# Altium schematic sheet SAMA7D65_PMIC.SchDoc
size 420 x 297 mm; SheetNumber: 6; SheetTotal: 23
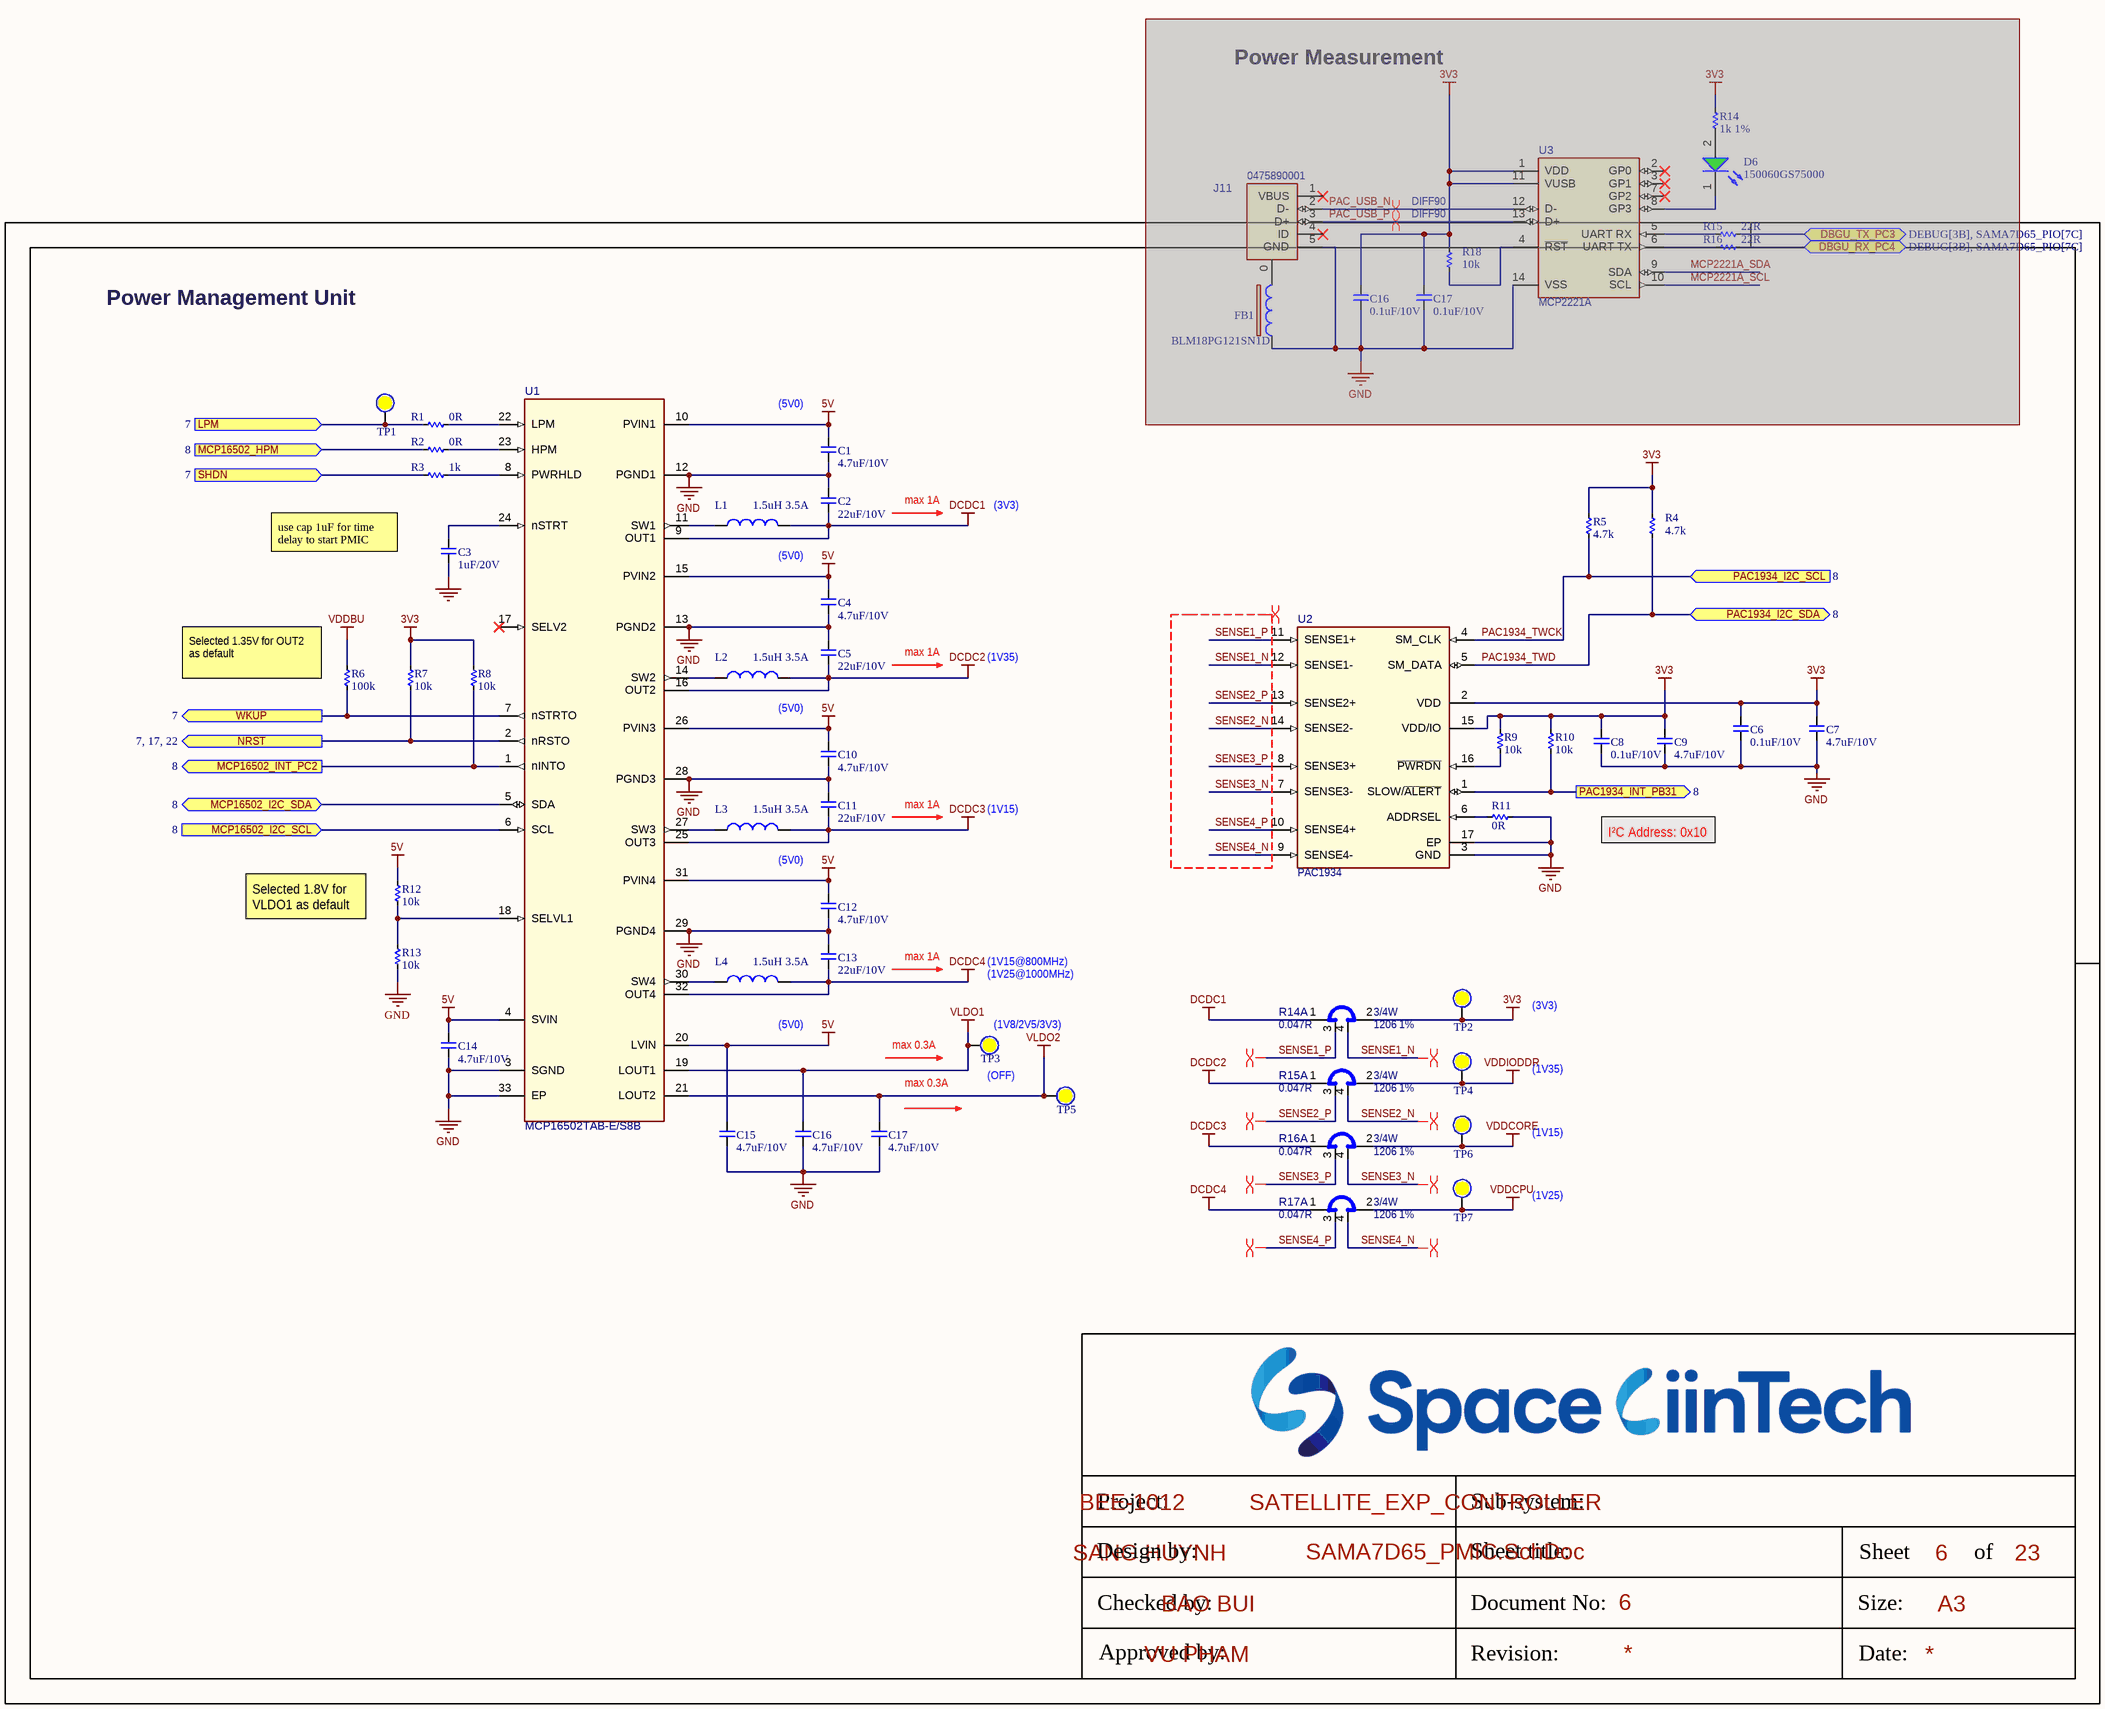
[diagram p0: SAMA7D65_PMIC.SchDoc]

## Parts
(Parts that share a designator on the sheet are numbered #1, #2 ... from top to bottom, then left to right.)
C1  4.7uF/10V  [CAP_C_1005X50_L]
C2  22uF/10V  [CAP_C_1608X80]
C3  1uF/20V  [CAP_C_1005X50_L]
C4  4.7uF/10V  [CAP_C_1005X50_L]
C5  22uF/10V  [CAP_C_1608X80]
C6  0.1uF/10V  [CAP_C_1005X50_L]
C7  4.7uF/10V  [CAP_C_1005X50_L]
C8  0.1uF/10V  [CAP_C_0603x30]
C9  4.7uF/10V  [CAP_C_1005X50_L - duplicate]
C10  4.7uF/10V  [CAP_C_1005X50_L]
C11  22uF/10V  [CAP_C_1608X80]
C12  4.7uF/10V  [CAP_C_1005X50_L]
C13  22uF/10V  [CAP_C_1608X80]
C14  4.7uF/10V  [CAP_C_1005X50_L - duplicate]
C15  4.7uF/10V  [CAP_C_1005X50_L]
C16#1  0.1uF/10V  [CAP_C_1005X60]  (masked out: inside a compile mask, not in the netlist)
C16#2  4.7uF/10V  [CAP_C_1005X50_L]
C17#1  0.1uF/10V  [CAP_C_1005X60]  (masked out: inside a compile mask, not in the netlist)
C17#2  4.7uF/10V  [CAP_C_1005X50_L]
D6  150060GS75000  [LED-0603-GREEN]  (masked out: inside a compile mask, not in the netlist)
FB1  BLM18PG121SN1D  [IND_BLM18_0603_MUR]  (masked out: inside a compile mask, not in the netlist)
J11  value 0475890001  [CON_USB_Micro-AB_SMD_RA_MOLEX_0475890001]  (hidden comment: CON USB2.0 Mini_Micro)  (masked out: inside a compile mask, not in the netlist)
L1  1.5uH 3.5A  [IND_C_1008]
L2  1.5uH 3.5A  [IND_C_1008]
L3  1.5uH 3.5A  [IND_C_1008]
L4  1.5uH 3.5A  [IND_C_1008]
R1  0R  [RES_C_0603X30]
R2  0R  [RES_C_0603X30]
R3  1k  [RES_C_0603X30]
R4  4.7k  [RES_C_1005x30_L]
R5  4.7k  [RES_C_1005x30_L]
R6  100k  [RES_C_0603X30]
R7  10k  [RES_C_0603X30]
R8  10k  [RES_C_0603X30]
R9  10k  [RES_C_1005x30_L]
R10  10k  [RES_C_1005x30_L]
R11  0R  [RES_C_0603X30]
R12  10k  [RES_C_1005x30_L]
R13  10k  [RES_C_1005x30_L]
R14#1  1k 1%  [RES_C_1005x30_L]  (masked out: inside a compile mask, not in the netlist)
R14#2  value 0.047R  Package: 1206  Tolerance: 1%  Power: 3/4W  [RES_C_1206_SHUNT]  (hidden comment: Shunt 4 Pin)  (part A of 2)
R15#1  22R  [RES_C_1005x30_L]  (masked out: inside a compile mask, not in the netlist)
R15#2  value 0.047R  Package: 1206  Tolerance: 1%  Power: 3/4W  [RES_C_1206_SHUNT]  (hidden comment: Shunt 4 Pin)  (part A of 2)
R16#1  22R  [RES_C_1005x30_L]  (masked out: inside a compile mask, not in the netlist)
R16#2  value 0.047R  Package: 1206  Tolerance: 1%  Power: 3/4W  [RES_C_1206_SHUNT]  (hidden comment: Shunt 4 Pin)  (part A of 2)
R17  value 0.047R  Package: 1206  Tolerance: 1%  Power: 3/4W  [RES_C_1206_SHUNT]  (hidden comment: Shunt 4 Pin)  (part A of 2)
R18  10k  [RES_C_1005x30_L]  (masked out: inside a compile mask, not in the netlist)
TP1  (no value)  [Test point]  (no BOM)
TP2  (no value)  [Test point]  (no BOM)
TP3  (no value)  [Test point]  (no BOM)
TP4  (no value)  [Test point]  (no BOM)
TP5  (no value)  [Test point]  (no BOM)
TP6  (no value)  [Test point]  (no BOM)
TP7  (no value)  [Test point]  (no BOM)
U1  value MCP16502TAB-E/S8B  [QFN-32_5X5_EP3.7X3.7]  (hidden comment: MCP16502 QFN-32)
U2  value PAC1934  [UQFN-16_4X4_EP2.6X2.6]  (hidden comment: Microchip PAC1934 UQFN-16)
U3  value MCP2221A  [SOIC-14]  (hidden comment: MCP2221 SOIC-14_TSSOP-14_PDIP-14)  (masked out: inside a compile mask, not in the netlist)

## Ports
DBGU_RX_PC4 (bidir, see DEBUG[3B], SAMA7D65_PIO[7C]), DBGU_TX_PC3 (bidir, see DEBUG[3B], SAMA7D65_PIO[7C]), LPM (in, see 7), MCP16502_HPM (in, see 8), MCP16502_I2C_SCL (in, see 8), MCP16502_I2C_SDA (bidir, see 8), MCP16502_INT_PC2 (out, see 8), NRST (out, see 7, 17, 22), PAC1934_I2C_SCL (in, see 8), PAC1934_I2C_SDA (bidir, see 8), PAC1934_INT_PB31 (out, see 8), SHDN (in, see 7), WKUP (out, see 7)

## Nets
3V3: C6.2 C7.2 C8.2 C9.2 R4.1 R5.1 R7.2 R8.2 R9.2 R10.2 R14#2.2 TP2.0 U2.2(VDD) U2.15(VDD/IO)
5V: C1.2 C4.2 C10.2 C12.2 C14.2 C15.2 R12.2 U1.4(SVIN) U1.10(PVIN1) U1.15(PVIN2) U1.20(LVIN) U1.26(PVIN3) U1.31(PVIN4)
DCDC1: C2.1 L1.2 R14#2.1 U1.9(OUT1)
DCDC2: C5.1 L2.2 R15#2.1 U1.16(OUT2)
DCDC3: C11.1 L3.2 R16#2.1 U1.25(OUT3)
DCDC4: C13.1 L4.2 R17.1 U1.32(OUT4)
GND: C1.1 C2.2 C3.1 C4.1 C5.2 C6.1 C7.1 C8.1 C9.1 C10.1 C11.2 C12.1 C13.2 C14.1 C15.1 C16#2.1 C17#2.1 R11.2 R13.1 U1.3(SGND) U1.12(PGND1) U1.13(PGND2) U1.28(PGND3) U1.29(PGND4) U1.33(EP) U2.3(GND) U2.17(EP)
VDDBU: R6.2
VDDCORE: R16#2.2 TP6.0
VDDCPU: R17.2 TP7.0
VDDIODDR: R15#2.2 TP4.0
VLDO1: C16#2.2 TP3.0 U1.19(LOUT1)
VLDO2: C17#2.2 TP5.0 U1.21(LOUT2)
LPM: R1.1 TP1.0 ; port LPM
MCP16502_HPM: R2.1 ; port MCP16502_HPM
MCP16502_I2C_SCL: U1.6(SCL) ; port MCP16502_I2C_SCL
MCP16502_I2C_SDA: U1.5(SDA) ; port MCP16502_I2C_SDA
MCP16502_INT_PC2: R8.1 U1.1(nINTO) ; port MCP16502_INT_PC2
NRST: R7.1 U1.2(nRSTO) ; port NRST
PAC1934_INT_PB31: R10.1 U2.1(SLOW/~{ALERT}) ; port PAC1934_INT_PB31
PAC1934_TWCK: R5.2 U2.4(SM_CLK) ; port PAC1934_I2C_SCL
PAC1934_TWD: R4.2 U2.5(SM_DATA) ; port PAC1934_I2C_SDA
SENSE1_N: R14#2.4 U2.12(SENSE1-)
SENSE1_P: R14#2.3 U2.11(SENSE1+)
SENSE2_N: R15#2.4 U2.14(SENSE2-)
SENSE2_P: R15#2.3 U2.13(SENSE2+)
SENSE3_N: R16#2.4 U2.7(SENSE3-)
SENSE3_P: R16#2.3 U2.8(SENSE3+)
SENSE4_N: R17.4 U2.9(SENSE4-)
SENSE4_P: R17.3 U2.10(SENSE4+)
SHDN: R3.1 ; port SHDN
WKUP: R6.1 U1.7(nSTRTO) ; port WKUP
NetC3_2: C3.2 U1.24(nSTRT)
NetL1_1: L1.1 U1.11(SW1)
NetL2_1: L2.1 U1.14(SW2)
NetL3_1: L3.1 U1.27(SW3)
NetL4_1: L4.1 U1.30(SW4)
NetR1_2: R1.2 U1.22(LPM)
NetR2_2: R2.2 U1.23(HPM)
NetR3_2: R3.2 U1.8(PWRHLD)
NetR9_1: R9.1 U2.16(~{PWRDN})
NetR11_1: R11.1 U2.6(ADDRSEL)
NetR12_1: R12.1 R13.2 U1.18(SELVL1)

Not connected (* = marked no-connect by the designer): U1 17(SELV2)*

## Layout directives
differential pair: SENSE1_N, SENSE1_P, SENSE2_N, SENSE2_P, SENSE3_N, SENSE3_P, SENSE4_N, SENSE4_P
differential pair; differential pair class DIFF90; net class DIFF90; rule Matched Net Lengths [Tolerance = 4mil]: (no net found under the mark), SENSE1_N, SENSE1_P, SENSE2_N, SENSE2_P, SENSE3_N, SENSE3_P, SENSE4_N, SENSE4_P

## Notes on the sheet
- Power Measurement
- Power Management Unit
- (near C1) (5V0)
- max 1A
- (3V3)
- use cap 1uF for time delay to start PMIC
- (near L1) (5V0)
- (near R6) Selected 1.35V for OUT2 as default
- (near L2) (5V0)
- (1V35)
- (1V15)
- I²C Address: 0x10
- (near L3) (5V0)
- Selected 1.8V for VLDO1 as default
- (1V15@800MHz)
- (near L4) (5V0)
- (1V25@1000MHz)
- (near TP3) (1V8/2V5/3V3)
- (near TP3) max 0.3A
- max 0.3A
- (near TP3) (OFF)
- (1V25)
- Project:
- BEE-1012
- Sub-system:
- SATELLITE_EXP_CONTROLLER
- Design by:
- SANG HUYNH
- BAO BUI
- Sheet title:
- Sheet
- A3
- of
- Checked by:
- Approved by:
- VU PHAM
- Revision:
- Document No:
- Size:
- Date:

## Library data of the parts
C1-C15 C16#1 C16#2 C17#1 C17#2 = _CAP_C_2: CAP CHIP
D6 = LED_GREEN: LED GREEN CLEAR 0603 SMD
FB1 = BLM18PG121SN1D: FERRITE BEAD 120 OHM 0603 1LN; Manufacturer_Name: Murata; Copyright: Copyright (C) 2025 Ultra Librarian. All rights reserved.; Manufacturer_Part_Number: BLM18PG121SN1D
J11 = 0475890001: CONN RCPT MICRO USB AB 5P SMD RA; Manufacturer 1: Molex, LLC; MCHP-ID: CON1753; Description_: CON USB2.0 MICRO-AB FEMALE SMD R/A; Dev Tools Status: Production; Owner: Dragos Danaila; Voltage: 30VAC; Current: 1A, 1.8A; Custom Parameters: 10000 mating cycles; Populated: YES; Revision: 1; Symbol: CON USB2.0 Mini_Micro; Status: MCL Design; ComponentLink1URL: https://chn-vm-apps.microchip.com/mchprepo/parts/Datasheets/475890001_sd.pdf; ComponentLink1Description: SVN Datasheet; ComponentLink2URL: C:\ALTIUM_WORK\00001_MCHP-CDB\Datasheets\475890001_sd.pdf; ComponentLink2Description: Local Datasheet; ComponentLink3URL: C:\ALTIUM_WORK\00001_MCHP-CDB\Library\LibraryRefs\CON USB2.0 Mini_Micro.SchLib; ComponentLink3Description: Open Symbol; ComponentLink4URL: C:\ALTIUM_WORK\00001_MCHP-CDB\Library\Footprints\CON_USB_Micro-AB_SMD_RA_MOLEX_0475890001.PcbLib; ComponentLink4Description: Open Footprint; ComponentLink5Description: Open Footprint 2; ComponentLink6Description: Open Footprint 3; ComponentLink7Description: Open Footprint 4; Type: USB; Category: Connector; Manufacturer Part Number 1: 0475890001; Supplier 1: Digi-Key; Supplier Part Number 1: WM17143CT-ND; Quantity Override: 1; Operating Temperature: -35C to +85C; Assembly Type: SMD
L1-L4 = DFE252012P-1R5M=P2: Fixed Inductor 1.5uH 3.5A R060 SMD; Package: None; Price: None; Value: *; MP: DFE252012P-1R5M=P2; Availability: Unavailable
R1-R13 R14#1 R15#1 R16#1 R18 = _RES_B_2: RES
R14#2 R15#2 R16#2 R17 = SHUNT: Shunt Resistor, RES 0.047 OHM 1% 3/4W 1206; Manufacturer 1: SUSUMU; Manufacturer Part Number 1: KRL1632E-M-R047-F-T5; MCHP-ID: RSMT1405; Description_: RES SHUNT MF 0.047R 1% 3/4W SMD 1206; Dev Tools Status: Design; Current: 4A; Owner: Ciprian Abramov; Populated: YES; Temperature Coefficient: ±50ppm/C; Restricted Sourcing: No; Revision: 1; Symbol: Shunt 4 Pin; Status: MCL Design; ComponentLink1URL: https://chn-vm-apps.microchip.com/mchprepo/parts/Datasheets/n_catalog_partition09_en.pdf; ComponentLink1Description: SVN Datasheet; ComponentLink2URL: C:\ALTIUM_WORK\00001_MCHP-CDB\Datasheets\n_catalog_partition09_en.pdf; ComponentLink2Description: Local Datasheet; ComponentLink3URL: C:\ALTIUM_WORK\00001_MCHP-CDB\Library\LibraryRefs\Shunt 4 Pin.SchLib; ComponentLink3Description: Open Symbol; ComponentLink4URL: C:\ALTIUM_WORK\00001_MCHP-CDB\Library\Footprints\RES_C_1206_SHUNT.PcbLib; ComponentLink4Description: Open Footprint; ComponentLink5Description: Open Footprint 2; ComponentLink6Description: Open Footprint 3; ComponentLink7Description: Open Footprint 4; Operating Temperature: -55C to 155C; Category: Resistor; Type: Shunt; Composition: MF; Supplier 1: Digi-Key; Supplier Part Number 1: 408-1578-2-ND; Quantity Override: 1
TP1-TP7 = Test Point: Solder: NF
U1 = MIC8878: Manufacturer 1: Microchip Technology; Populated: YES; Description_: MCHP ANALOG PMIC SWITCHER Buck ADJ MCP16502TAB-E/S8B QFN-32 for SAMA7G5 MPU with LPDDR/DDR2/DDR3; Dev Tools Status: Design; Owner: Dragos Danaila; MCHP-ID: MIC8878; Symbol: MCP16502 QFN-32; Type: Switcher; Status: MCL Design; Revision: 1; Category: MCHP-Analog; ComponentLink1Description: SVN Datasheet; ComponentLink2Description: Local Datasheet; ComponentLink3URL: C:\ALTIUM_WORK\00001_MCHP-CDB\Library\LibraryRefs\MCP16502 QFN-32.SchLib; ComponentLink3Description: Open Symbol; ComponentLink4URL: C:\ALTIUM_WORK\00001_MCHP-CDB\Library\Footprints\QFN-32_5X5_EP3.7X3.7.PcbLib; ComponentLink4Description: Open Footprint; ComponentLink5Description: Open Footprint 2; ComponentLink6Description: Open Footprint 3; ComponentLink7Description: Open Footprint 4; Manufacturer Part Number 1: MCP16502TAB-E/S8B; Supplier 1: Digi-Key; Supplier Part Number 1: 150-MCP16502TAB-E/S8BCT-ND; Quantity Override: 1; ComponentLink2URL: C:\ALTIUM_WORK\00001_MCHP-CDB\Datasheets\MCP16502-High-Performance-PMIC-for-SAMA5DX-SAM9X6-MPUs-Data-Sheet-DS20006275B.pdf
U2 = PAC1934T-I/JQ: IC CURRENT MONITOR 1% 16UQFN; Manufacturer 1: Microchip Technology; MCHP-ID: MIC7010; Description_: MCHP ANALOG POWER CURRENT SENSE MONITOR PAC1934T-I/JQ UQFN-16; Dev Tools Status: Production; Owner: Razvan Cristescu; Populated: YES; Restricted Sourcing: No; Symbol: PAC1934 UQFN-16; Type: Power/Current Sensor; Status: MCL Design; Revision: 2; Category: MCHP-Analog; ComponentLink1Description: SVN Datasheet; ComponentLink2Description: Local Datasheet; ComponentLink3URL: C:\ALTIUM_WORK\00001_MCHP-CDB\Library\LibraryRefs\PAC1934 UQFN-16.SchLib; ComponentLink3Description: Open Symbol; ComponentLink4URL: C:\ALTIUM_WORK\00001_MCHP-CDB\Library\Footprints\UQFN-16_4X4_EP2.6X2.6.PcbLib; ComponentLink4Description: Open Footprint; ComponentLink5Description: Open Footprint 2; ComponentLink6Description: Open Footprint 3; ComponentLink7Description: Open Footprint 4; Manufacturer Part Number 1: PAC1934T-I/JQ; Supplier 1: Microchip Technology; Supplier Part Number 1: PAC1934T-I/JQ; Quantity Override: 1; ComponentLink1URL: https://www.microchip.com/sitesearch/search/Product%20and%20Development%20Tools/PAC1934T-I/JQ; Operating Temperature: -40C to +85C
U3 = MCP2221A-I/SL: IC USB TO I2C/UART 14SOIC; Manufacturer 1: Microchip Technology; MCHP-ID: MIC9078; Description_: MCHP INTERFACE USB I2C UART MCP2221A-I/SL SOIC-14; Dev Tools Status: Design; Owner: Octavian Stroe; Populated: YES; Symbol: MCP2221 SOIC-14_TSSOP-14_PDIP-14; Type: USB; Status: MCL Design; Revision: A; Category: MCHP-Interface; ComponentLink1URL: https://chn-vm-apps.microchip.com/mchprepo/parts/Datasheets/20005292B.pdf; ComponentLink1Description: SVN Datasheet; ComponentLink2URL: C:\ALTIUM_WORK\00001_MCHP-CDB\Datasheets\20005292B.pdf; ComponentLink2Description: Local Datasheet; ComponentLink3URL: C:\ALTIUM_WORK\00001_MCHP-CDB\Library\LibraryRefs\MCP2221 SOIC-14_TSSOP-14_PDIP-14.SchLib; ComponentLink3Description: Open Symbol; ComponentLink4URL: C:\ALTIUM_WORK\00001_MCHP-CDB\Library\Footprints\SOIC-14.PcbLib; ComponentLink4Description: Open Footprint; ComponentLink5Description: Open Footprint 2; ComponentLink6Description: Open Footprint 3; ComponentLink7Description: Open Footprint 4; Manufacturer Part Number 1: MCP2221A-I/SL; Manufacturer 2: Microchip Technology; Manufacturer Part Number 2: MCP2221A-I/SL; Supplier 1: Digi-Key; Supplier Part Number 1: MCP2221A-I/SL-ND; Supplier 2: Mouser; Supplier Part Number 2: 579-MCP2221A-I/SL; Operating Temperature: -40C to +85C; Quantity Override: 1